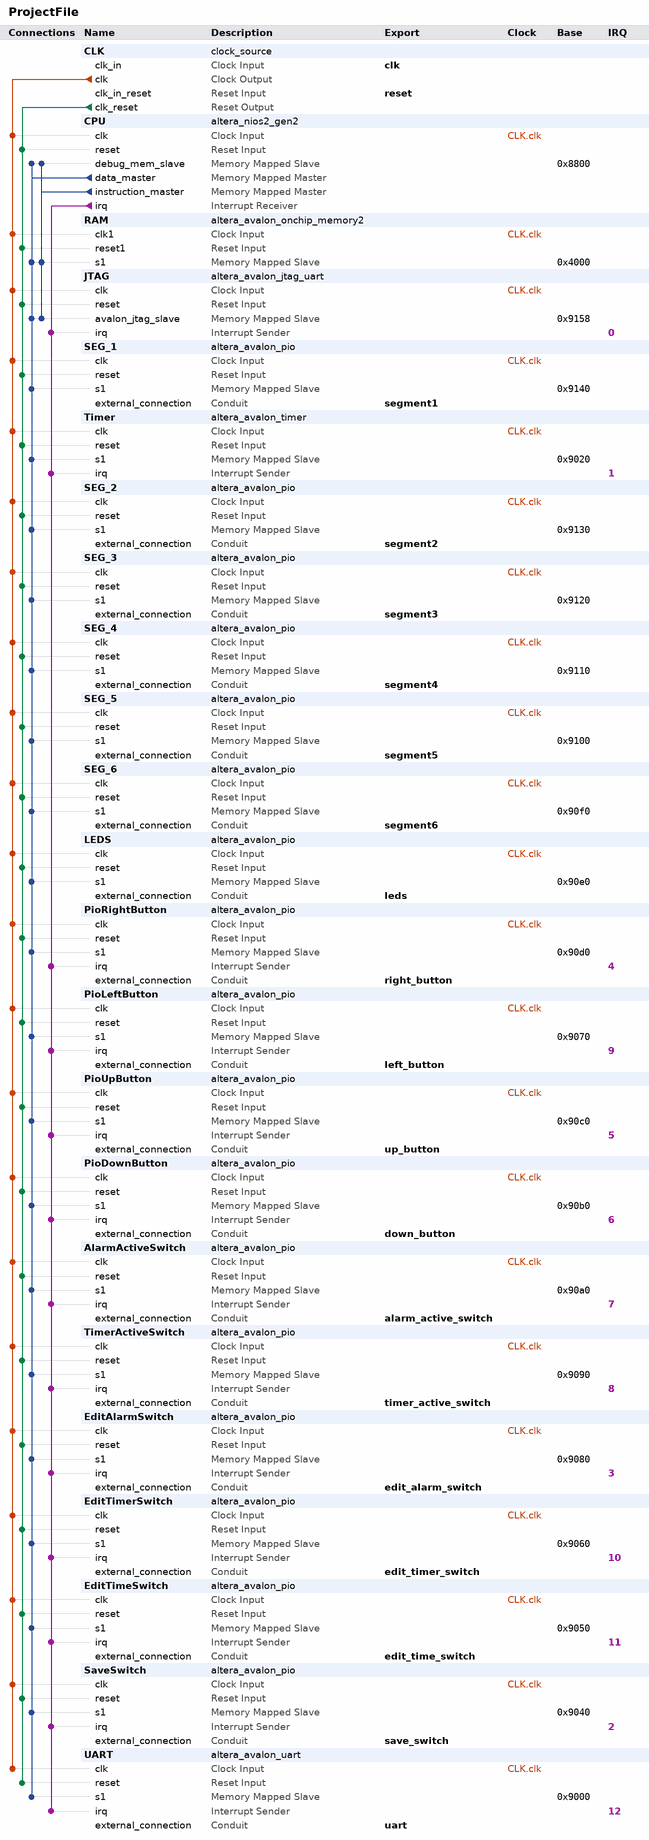
[diagram p0: system contents]
# Platform Designer (Qsys) system ProjectFile, Cyclone V 5CSEMA5F31C6
# Parameters at their usual value, and those the tool derives, are not listed.
package require -exact qsys 20.1
create_system ProjectFile
set_project_property DEVICE_FAMILY {Cyclone V}
set_project_property DEVICE 5CSEMA5F31C6

add_instance CLK clock_source 20.1
set_instance_parameter_value CLK clockFrequency 50000000

add_instance CPU altera_nios2_gen2 20.1
set_instance_parameter_value CPU dcache_size 2048
set_instance_parameter_value CPU exceptionSlave RAM.s1
set_instance_parameter_value CPU icache_size 4096
set_instance_parameter_value CPU impl Tiny
set_instance_parameter_value CPU resetSlave RAM.s1

add_instance RAM altera_avalon_onchip_memory2 20.1
set_instance_parameter_value RAM dataWidth 32
set_instance_parameter_value RAM dualPort false
set_instance_parameter_value RAM initMemContent true
set_instance_parameter_value RAM initializationFileName A:/Nios2AlarmClock/software/alarm-clock/mem_init/ProjectFile_RAM.hex
set_instance_parameter_value RAM memorySize 16384

add_instance JTAG altera_avalon_jtag_uart 20.1
set_instance_parameter_value JTAG simInteractiveOptions NO_INTERACTIVE_WINDOWS

add_instance SEG_1 altera_avalon_pio 20.1
set_instance_parameter_value SEG_1 direction Output
set_instance_parameter_value SEG_1 width 8

add_instance Timer altera_avalon_timer 20.1
set_instance_parameter_value Timer period 1
set_instance_parameter_value Timer periodUnits SEC

add_instance SEG_2 altera_avalon_pio 20.1
set_instance_parameter_value SEG_2 direction Output
set_instance_parameter_value SEG_2 width 8

add_instance SEG_3 altera_avalon_pio 20.1
set_instance_parameter_value SEG_3 direction Output
set_instance_parameter_value SEG_3 width 8

add_instance SEG_4 altera_avalon_pio 20.1
set_instance_parameter_value SEG_4 direction Output
set_instance_parameter_value SEG_4 width 8

add_instance SEG_5 altera_avalon_pio 20.1
set_instance_parameter_value SEG_5 direction Output
set_instance_parameter_value SEG_5 width 8

add_instance SEG_6 altera_avalon_pio 20.1
set_instance_parameter_value SEG_6 direction Output
set_instance_parameter_value SEG_6 width 8

add_instance LEDS altera_avalon_pio 20.1
set_instance_parameter_value LEDS direction Output
set_instance_parameter_value LEDS width 10

add_instance PioRightButton altera_avalon_pio 20.1
set_instance_parameter_value PioRightButton captureEdge true
set_instance_parameter_value PioRightButton direction Input
set_instance_parameter_value PioRightButton edgeType FALLING
set_instance_parameter_value PioRightButton generateIRQ true
set_instance_parameter_value PioRightButton irqType EDGE
set_instance_parameter_value PioRightButton width 1

add_instance PioLeftButton altera_avalon_pio 20.1
set_instance_parameter_value PioLeftButton captureEdge true
set_instance_parameter_value PioLeftButton direction Input
set_instance_parameter_value PioLeftButton edgeType FALLING
set_instance_parameter_value PioLeftButton generateIRQ true
set_instance_parameter_value PioLeftButton irqType EDGE
set_instance_parameter_value PioLeftButton width 1

add_instance PioUpButton altera_avalon_pio 20.1
set_instance_parameter_value PioUpButton captureEdge true
set_instance_parameter_value PioUpButton direction Input
set_instance_parameter_value PioUpButton edgeType FALLING
set_instance_parameter_value PioUpButton generateIRQ true
set_instance_parameter_value PioUpButton irqType EDGE
set_instance_parameter_value PioUpButton width 1

add_instance PioDownButton altera_avalon_pio 20.1
set_instance_parameter_value PioDownButton captureEdge true
set_instance_parameter_value PioDownButton direction Input
set_instance_parameter_value PioDownButton edgeType FALLING
set_instance_parameter_value PioDownButton generateIRQ true
set_instance_parameter_value PioDownButton irqType EDGE
set_instance_parameter_value PioDownButton width 1

add_instance AlarmActiveSwitch altera_avalon_pio 20.1
set_instance_parameter_value AlarmActiveSwitch captureEdge true
set_instance_parameter_value AlarmActiveSwitch direction Input
set_instance_parameter_value AlarmActiveSwitch edgeType FALLING
set_instance_parameter_value AlarmActiveSwitch generateIRQ true
set_instance_parameter_value AlarmActiveSwitch irqType EDGE
set_instance_parameter_value AlarmActiveSwitch width 1

add_instance TimerActiveSwitch altera_avalon_pio 20.1
set_instance_parameter_value TimerActiveSwitch captureEdge true
set_instance_parameter_value TimerActiveSwitch direction Input
set_instance_parameter_value TimerActiveSwitch edgeType FALLING
set_instance_parameter_value TimerActiveSwitch generateIRQ true
set_instance_parameter_value TimerActiveSwitch irqType EDGE
set_instance_parameter_value TimerActiveSwitch width 1

add_instance EditAlarmSwitch altera_avalon_pio 20.1
set_instance_parameter_value EditAlarmSwitch captureEdge true
set_instance_parameter_value EditAlarmSwitch direction Input
set_instance_parameter_value EditAlarmSwitch edgeType FALLING
set_instance_parameter_value EditAlarmSwitch generateIRQ true
set_instance_parameter_value EditAlarmSwitch irqType EDGE
set_instance_parameter_value EditAlarmSwitch width 1

add_instance EditTimerSwitch altera_avalon_pio 20.1
set_instance_parameter_value EditTimerSwitch captureEdge true
set_instance_parameter_value EditTimerSwitch direction Input
set_instance_parameter_value EditTimerSwitch edgeType FALLING
set_instance_parameter_value EditTimerSwitch generateIRQ true
set_instance_parameter_value EditTimerSwitch irqType EDGE
set_instance_parameter_value EditTimerSwitch width 1

add_instance EditTimeSwitch altera_avalon_pio 20.1
set_instance_parameter_value EditTimeSwitch captureEdge true
set_instance_parameter_value EditTimeSwitch direction Input
set_instance_parameter_value EditTimeSwitch edgeType FALLING
set_instance_parameter_value EditTimeSwitch generateIRQ true
set_instance_parameter_value EditTimeSwitch irqType EDGE
set_instance_parameter_value EditTimeSwitch width 1

add_instance SaveSwitch altera_avalon_pio 20.1
set_instance_parameter_value SaveSwitch captureEdge true
set_instance_parameter_value SaveSwitch direction Input
set_instance_parameter_value SaveSwitch edgeType FALLING
set_instance_parameter_value SaveSwitch generateIRQ true
set_instance_parameter_value SaveSwitch irqType EDGE
set_instance_parameter_value SaveSwitch width 1

add_instance UART altera_avalon_uart 20.1
set_instance_parameter_value UART baud 115200
set_instance_parameter_value UART dataBits 8
set_instance_parameter_value UART fixedBaud true
set_instance_parameter_value UART parity NONE
set_instance_parameter_value UART stopBits 1

# connections
add_connection CLK.clk AlarmActiveSwitch.clk clock
add_connection CLK.clk CPU.clk clock
add_connection CLK.clk EditAlarmSwitch.clk clock
add_connection CLK.clk EditTimerSwitch.clk clock
add_connection CLK.clk EditTimeSwitch.clk clock
add_connection CLK.clk JTAG.clk clock
add_connection CLK.clk LEDS.clk clock
add_connection CLK.clk PioDownButton.clk clock
add_connection CLK.clk PioLeftButton.clk clock
add_connection CLK.clk PioRightButton.clk clock
add_connection CLK.clk PioUpButton.clk clock
add_connection CLK.clk RAM.clk1 clock
add_connection CLK.clk SaveSwitch.clk clock
add_connection CLK.clk SEG_1.clk clock
add_connection CLK.clk SEG_2.clk clock
add_connection CLK.clk SEG_3.clk clock
add_connection CLK.clk SEG_4.clk clock
add_connection CLK.clk SEG_5.clk clock
add_connection CLK.clk SEG_6.clk clock
add_connection CLK.clk Timer.clk clock
add_connection CLK.clk TimerActiveSwitch.clk clock
add_connection CLK.clk UART.clk clock
add_connection CLK.clk_reset AlarmActiveSwitch.reset reset
add_connection CLK.clk_reset CPU.reset reset
add_connection CLK.clk_reset EditAlarmSwitch.reset reset
add_connection CLK.clk_reset EditTimerSwitch.reset reset
add_connection CLK.clk_reset EditTimeSwitch.reset reset
add_connection CLK.clk_reset JTAG.reset reset
add_connection CLK.clk_reset LEDS.reset reset
add_connection CLK.clk_reset PioDownButton.reset reset
add_connection CLK.clk_reset PioLeftButton.reset reset
add_connection CLK.clk_reset PioRightButton.reset reset
add_connection CLK.clk_reset PioUpButton.reset reset
add_connection CLK.clk_reset RAM.reset1 reset
add_connection CLK.clk_reset SaveSwitch.reset reset
add_connection CLK.clk_reset SEG_1.reset reset
add_connection CLK.clk_reset SEG_2.reset reset
add_connection CLK.clk_reset SEG_3.reset reset
add_connection CLK.clk_reset SEG_4.reset reset
add_connection CLK.clk_reset SEG_5.reset reset
add_connection CLK.clk_reset SEG_6.reset reset
add_connection CLK.clk_reset Timer.reset reset
add_connection CLK.clk_reset TimerActiveSwitch.reset reset
add_connection CLK.clk_reset UART.reset reset
add_connection CPU.data_master AlarmActiveSwitch.s1 avalon
set_connection_parameter_value CPU.data_master/AlarmActiveSwitch.s1 baseAddress 0x90a0
add_connection CPU.data_master CPU.debug_mem_slave avalon
set_connection_parameter_value CPU.data_master/CPU.debug_mem_slave baseAddress 0x8800
add_connection CPU.data_master EditAlarmSwitch.s1 avalon
set_connection_parameter_value CPU.data_master/EditAlarmSwitch.s1 baseAddress 0x9080
add_connection CPU.data_master EditTimerSwitch.s1 avalon
set_connection_parameter_value CPU.data_master/EditTimerSwitch.s1 baseAddress 0x9060
add_connection CPU.data_master EditTimeSwitch.s1 avalon
set_connection_parameter_value CPU.data_master/EditTimeSwitch.s1 baseAddress 0x9050
add_connection CPU.data_master JTAG.avalon_jtag_slave avalon
set_connection_parameter_value CPU.data_master/JTAG.avalon_jtag_slave baseAddress 0x9158
add_connection CPU.data_master LEDS.s1 avalon
set_connection_parameter_value CPU.data_master/LEDS.s1 baseAddress 0x90e0
add_connection CPU.data_master PioDownButton.s1 avalon
set_connection_parameter_value CPU.data_master/PioDownButton.s1 baseAddress 0x90b0
add_connection CPU.data_master PioLeftButton.s1 avalon
set_connection_parameter_value CPU.data_master/PioLeftButton.s1 baseAddress 0x9070
add_connection CPU.data_master PioRightButton.s1 avalon
set_connection_parameter_value CPU.data_master/PioRightButton.s1 baseAddress 0x90d0
add_connection CPU.data_master PioUpButton.s1 avalon
set_connection_parameter_value CPU.data_master/PioUpButton.s1 baseAddress 0x90c0
add_connection CPU.data_master RAM.s1 avalon
set_connection_parameter_value CPU.data_master/RAM.s1 baseAddress 0x4000
add_connection CPU.data_master SaveSwitch.s1 avalon
set_connection_parameter_value CPU.data_master/SaveSwitch.s1 baseAddress 0x9040
add_connection CPU.data_master SEG_1.s1 avalon
set_connection_parameter_value CPU.data_master/SEG_1.s1 baseAddress 0x9140
add_connection CPU.data_master SEG_2.s1 avalon
set_connection_parameter_value CPU.data_master/SEG_2.s1 baseAddress 0x9130
add_connection CPU.data_master SEG_3.s1 avalon
set_connection_parameter_value CPU.data_master/SEG_3.s1 baseAddress 0x9120
add_connection CPU.data_master SEG_4.s1 avalon
set_connection_parameter_value CPU.data_master/SEG_4.s1 baseAddress 0x9110
add_connection CPU.data_master SEG_5.s1 avalon
set_connection_parameter_value CPU.data_master/SEG_5.s1 baseAddress 0x9100
add_connection CPU.data_master SEG_6.s1 avalon
set_connection_parameter_value CPU.data_master/SEG_6.s1 baseAddress 0x90f0
add_connection CPU.data_master Timer.s1 avalon
set_connection_parameter_value CPU.data_master/Timer.s1 baseAddress 0x9020
add_connection CPU.data_master TimerActiveSwitch.s1 avalon
set_connection_parameter_value CPU.data_master/TimerActiveSwitch.s1 baseAddress 0x9090
add_connection CPU.data_master UART.s1 avalon
set_connection_parameter_value CPU.data_master/UART.s1 baseAddress 0x9000
add_connection CPU.instruction_master CPU.debug_mem_slave avalon
set_connection_parameter_value CPU.instruction_master/CPU.debug_mem_slave baseAddress 0x8800
add_connection CPU.instruction_master JTAG.avalon_jtag_slave avalon
set_connection_parameter_value CPU.instruction_master/JTAG.avalon_jtag_slave baseAddress 0x9158
add_connection CPU.instruction_master RAM.s1 avalon
set_connection_parameter_value CPU.instruction_master/RAM.s1 baseAddress 0x4000
add_connection CPU.irq AlarmActiveSwitch.irq interrupt
set_connection_parameter_value CPU.irq/AlarmActiveSwitch.irq irqNumber 7
add_connection CPU.irq EditAlarmSwitch.irq interrupt
set_connection_parameter_value CPU.irq/EditAlarmSwitch.irq irqNumber 3
add_connection CPU.irq EditTimerSwitch.irq interrupt
set_connection_parameter_value CPU.irq/EditTimerSwitch.irq irqNumber 10
add_connection CPU.irq EditTimeSwitch.irq interrupt
set_connection_parameter_value CPU.irq/EditTimeSwitch.irq irqNumber 11
add_connection CPU.irq JTAG.irq interrupt
set_connection_parameter_value CPU.irq/JTAG.irq irqNumber 0
add_connection CPU.irq PioDownButton.irq interrupt
set_connection_parameter_value CPU.irq/PioDownButton.irq irqNumber 6
add_connection CPU.irq PioLeftButton.irq interrupt
set_connection_parameter_value CPU.irq/PioLeftButton.irq irqNumber 9
add_connection CPU.irq PioRightButton.irq interrupt
set_connection_parameter_value CPU.irq/PioRightButton.irq irqNumber 4
add_connection CPU.irq PioUpButton.irq interrupt
set_connection_parameter_value CPU.irq/PioUpButton.irq irqNumber 5
add_connection CPU.irq SaveSwitch.irq interrupt
set_connection_parameter_value CPU.irq/SaveSwitch.irq irqNumber 2
add_connection CPU.irq Timer.irq interrupt
set_connection_parameter_value CPU.irq/Timer.irq irqNumber 1
add_connection CPU.irq TimerActiveSwitch.irq interrupt
set_connection_parameter_value CPU.irq/TimerActiveSwitch.irq irqNumber 8
add_connection CPU.irq UART.irq interrupt
set_connection_parameter_value CPU.irq/UART.irq irqNumber 12

# exported interfaces
add_interface alarm_active_switch conduit end
set_interface_property alarm_active_switch EXPORT_OF AlarmActiveSwitch.external_connection
add_interface clk clock sink
set_interface_property clk EXPORT_OF CLK.clk_in
add_interface down_button conduit end
set_interface_property down_button EXPORT_OF PioDownButton.external_connection
add_interface edit_alarm_switch conduit end
set_interface_property edit_alarm_switch EXPORT_OF EditAlarmSwitch.external_connection
add_interface edit_time_switch conduit end
set_interface_property edit_time_switch EXPORT_OF EditTimeSwitch.external_connection
add_interface edit_timer_switch conduit end
set_interface_property edit_timer_switch EXPORT_OF EditTimerSwitch.external_connection
add_interface leds conduit end
set_interface_property leds EXPORT_OF LEDS.external_connection
add_interface left_button conduit end
set_interface_property left_button EXPORT_OF PioLeftButton.external_connection
add_interface reset reset sink
set_interface_property reset EXPORT_OF CLK.clk_in_reset
add_interface right_button conduit end
set_interface_property right_button EXPORT_OF PioRightButton.external_connection
add_interface save_switch conduit end
set_interface_property save_switch EXPORT_OF SaveSwitch.external_connection
add_interface segment1 conduit end
set_interface_property segment1 EXPORT_OF SEG_1.external_connection
add_interface segment2 conduit end
set_interface_property segment2 EXPORT_OF SEG_2.external_connection
add_interface segment3 conduit end
set_interface_property segment3 EXPORT_OF SEG_3.external_connection
add_interface segment4 conduit end
set_interface_property segment4 EXPORT_OF SEG_4.external_connection
add_interface segment5 conduit end
set_interface_property segment5 EXPORT_OF SEG_5.external_connection
add_interface segment6 conduit end
set_interface_property segment6 EXPORT_OF SEG_6.external_connection
add_interface timer_active_switch conduit end
set_interface_property timer_active_switch EXPORT_OF TimerActiveSwitch.external_connection
add_interface uart conduit end
set_interface_property uart EXPORT_OF UART.external_connection
add_interface up_button conduit end
set_interface_property up_button EXPORT_OF PioUpButton.external_connection

set_interconnect_requirement {$system} qsys_mm.clockCrossingAdapter HANDSHAKE
set_interconnect_requirement {$system} qsys_mm.enableEccProtection FALSE
set_interconnect_requirement {$system} qsys_mm.insertDefaultSlave FALSE
set_interconnect_requirement {$system} qsys_mm.maxAdditionalLatency 1

save_system ProjectFile.qsys
